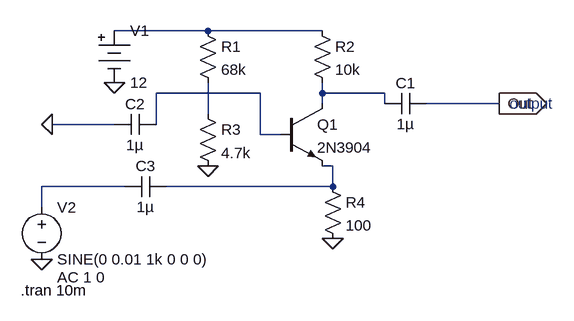
[diagram p0: schematic DESIGN AND SIMULATION OF COMMON BASE AMPLIFIER USING LTSPICE.asc]
DESIGN AND SIMULATION OF COMMON BASE AMPLIFIER USING LTSPICE.asc, the LTspice schematic file:
Version 4.1
SHEET 1 880 680
WIRE 176 64 32 64
WIRE 352 64 176 64
WIRE 256 160 96 160
WIRE 352 160 352 144
WIRE 448 160 352 160
WIRE 352 176 352 160
WIRE 448 176 448 160
WIRE 624 176 512 176
WIRE 176 192 176 144
WIRE 32 208 -64 208
WIRE 96 208 96 160
WIRE 256 224 256 160
WIRE 288 224 256 224
WIRE 368 272 352 272
WIRE 48 304 -80 304
WIRE 368 304 368 272
WIRE 368 304 112 304
WIRE -80 336 -80 304
FLAG 32 144 0
FLAG 176 272 0
FLAG 368 384 0
FLAG -80 416 0
FLAG -64 208 0
FLAG 624 176 Out
IOPIN 624 176 Out
SYMBOL Misc\\battery 32 48 R0
WINDOW 123 0 0 Left 0
WINDOW 39 0 0 Left 0
SYMATTR InstName V1
SYMATTR Value 12
SYMBOL res 160 48 R0
SYMATTR InstName R1
SYMATTR Value 68k
SYMBOL res 336 48 R0
SYMATTR InstName R2
SYMATTR Value 10k
SYMBOL res 160 176 R0
SYMATTR InstName R3
SYMATTR Value 4.7k
SYMBOL res 352 288 R0
SYMATTR InstName R4
SYMATTR Value 100
SYMBOL npn 288 176 R0
SYMATTR InstName Q1
SYMATTR Value 2N3904
SYMBOL voltage -80 320 R0
WINDOW 123 24 124 Left 2
WINDOW 39 0 0 Left 0
SYMATTR InstName V2
SYMATTR Value SINE(0 0.01 1k 0 0 0)
SYMATTR Value2 AC 1 0
SYMBOL cap 512 160 R90
WINDOW 0 0 32 VBottom 2
WINDOW 3 32 32 VTop 2
SYMATTR InstName C1
SYMATTR Value 1µ
SYMATTR SpiceLine V=16 Irms=0 Rser=11 Lser=0 mfg="AVX" pn="TAJA105K016" type="Tantalum"
SYMBOL cap 96 192 R90
WINDOW 0 0 32 VBottom 2
WINDOW 3 32 32 VTop 2
SYMATTR InstName C2
SYMATTR Value 1µ
SYMATTR SpiceLine V=16 Irms=0 Rser=11 Lser=0 mfg="AVX" pn="TAJA105K016" type="Tantalum"
SYMBOL cap 112 288 R90
WINDOW 0 0 32 VBottom 2
WINDOW 3 32 32 VTop 2
SYMATTR InstName C3
SYMATTR Value 1µ
SYMATTR SpiceLine V=16 Irms=0 Rser=11 Lser=0 mfg="AVX" pn="TAJA105K016" type="Tantalum"
TEXT 640 176 Left 2 ;output
TEXT -112 464 Left 2 !.tran 10m

The netlist it stands for:
* DESIGN AND SIMULATION OF COMMON BASE AMPLIFIER USING LTSPICE.asc
V1 N001 0 12
R1 N001 N004 68k
R2 N001 N003 10k
R3 N004 0 4.7k
R4 N005 0 100
Q1 N003 N002 N005 0 2N3904
V2 N006 0 SINE(0 0.01 1k 0 0 0) AC 1 0
C1 Out N003 1µ V=16 Irms=0 Rser=11 Lser=0 mfg="AVX" pn="TAJA105K016" type="Tantalum"
C2 N002 0 1µ V=16 Irms=0 Rser=11 Lser=0 mfg="AVX" pn="TAJA105K016" type="Tantalum"
C3 N005 N006 1µ V=16 Irms=0 Rser=11 Lser=0 mfg="AVX" pn="TAJA105K016" type="Tantalum"
.model NPN NPN
.model PNP PNP
.lib standard.bjt
* output
.tran 10m
.backanno
.end